# EAGLE design dfine_xb_v4 (EAGLE 5.06)
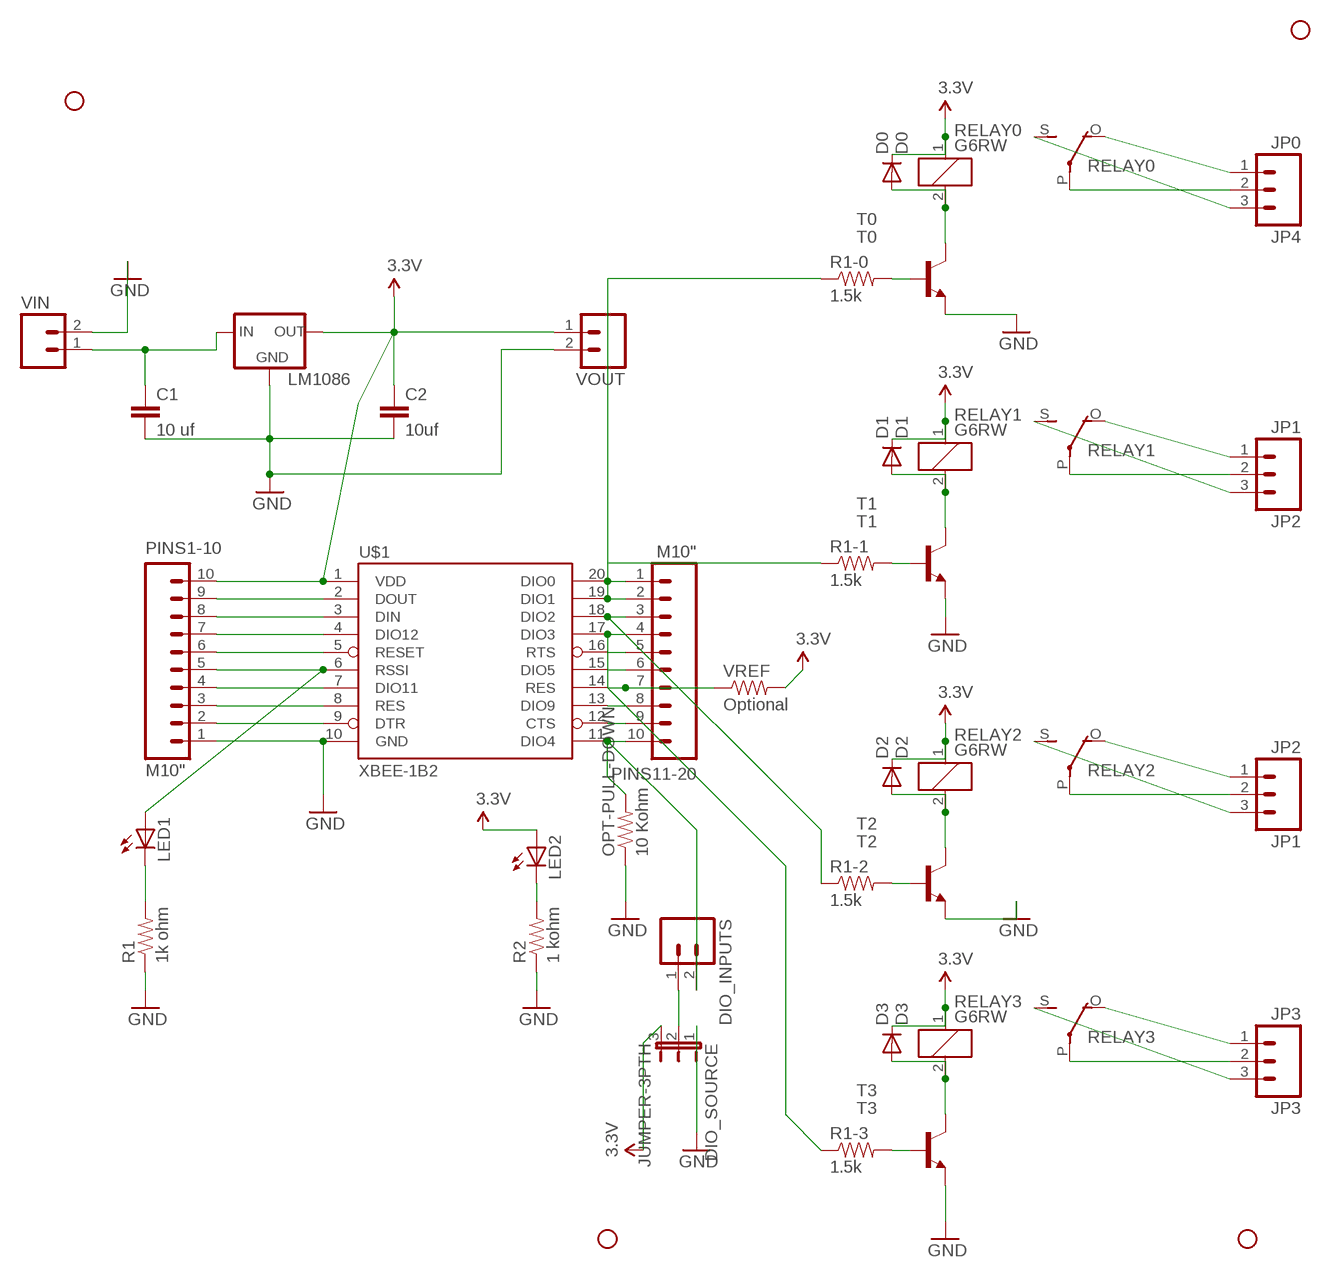
[diagram p0: schematic, sheet 1]

## Parts
C1  10 uf  CAPPTH  [CAP-PTH-SMALL]
C2  10uf  CAPPTH  [CAP-PTH-SMALL]
D0  D0  DIODEPTH  [DIODE-1N4001]
D1  D1  DIODEPTH  [DIODE-1N4001]
D2  D2  DIODEPTH  [DIODE-1N4001]
D3  D3  DIODEPTH  [DIODE-1N4001]
DIO_INPUTS  M023.5MM  [SCREWTERMINAL-3.5MM-2]
DIO_SOURCE  JUMPER-3PTH  [1X03]
JP1  JP2  M03SCREW  [SCREWTERMINAL-3.5MM-3]
JP2  JP1  M03SCREW  [SCREWTERMINAL-3.5MM-3]
JP3  JP3  M03SCREW  [SCREWTERMINAL-3.5MM-3]
JP4  JP0  M03SCREW  [SCREWTERMINAL-3.5MM-3]
JP5  STAND-OFF  [STAND-OFF]
JP6  STAND-OFF  [STAND-OFF]
JP7  STAND-OFF  [STAND-OFF]
JP8  STAND-OFF  [STAND-OFF]
LED1  LED3MM  [LED3MM]
LED2  LED3MM  [LED3MM]
LM1086  V_REG_78XXSINK  [TO220-IGO]
OPT-PULL-DOWN  10 Kohm  RESISTORPTH1  [AXIAL-0.3]
PINS1-10  M10"  [1X10]
PINS11-20  M10"  [1X10]
R1  1k ohm  RESISTORPTH1  [AXIAL-0.3]
R1-0  1.5k  RESISTORPTH1  [AXIAL-0.3]
R1-1  1.5k  RESISTORPTH1  [AXIAL-0.3]
R1-2  1.5k  RESISTORPTH1  [AXIAL-0.3]
R1-3  1.5k  RESISTORPTH1  [AXIAL-0.3]
R2  1 kohm  RESISTORPTH1  [AXIAL-0.3]
RELAY0  G6RW  [G6RW]
RELAY1  G6RW  [G6RW]
RELAY2  G6RW  [G6RW]
RELAY3  G6RW  [G6RW]
T0  T0  2N3565  [TO92]
T1  T1  2N3565  [TO92]
T2  T2  2N3565  [TO92]
T3  T3  2N3565  [TO92]
U$1  XBEE-1B2  [XBEE-SILK]
VIN  M023.5MM_LOCK  [SCREWTERMINAL-3.5MM-2_LOCK]
VOUT  M023.5MM  [SCREWTERMINAL-3.5MM-2]
VREF  Optional  RESISTORPTH1  [AXIAL-0.3]

## Nets
3.3V: C2.1 D0.C D1.C D2.C D3.C DIO_SOURCE.3 LED2.A LM1086.OUT PINS1-10.10 RELAY0.1 RELAY1.1 RELAY2.1 RELAY3.1 U$1.1(VDD) VOUT.1 VREF.P$2
GND: C1.2 C2.2 DIO_SOURCE.1 LM1086.GND OPT-PULL-DOWN.P$1 PINS1-10.1 R1.P$1 R2.P$1 T0.3(E) T1.3(E) T2.3(E) T3.3(E) U$1.10(GND) VIN.2 VOUT.2
N$1: PINS11-20.4 R1-3.P$1 U$1.17(DIO3)
N$2: PINS1-10.2 U$1.9(DTR)
N$3: PINS1-10.3 U$1.8(RES)
N$4: PINS1-10.4 U$1.7(DIO11)
N$5: LED1.A PINS1-10.5 U$1.6(RSSI)
N$6: PINS1-10.6 U$1.5(RESET)
N$7: PINS1-10.7 U$1.4(DIO12)
N$8: PINS1-10.8 U$1.3(DIN)
N$9: PINS1-10.9 U$1.2(DOUT)
N$10: PINS11-20.3 R1-2.P$1 U$1.18(DIO2)
N$11: R1-0.P$2 T0.2(B)
N$12: PINS11-20.2 R1-1.P$1 U$1.19(DIO1)
N$13: PINS11-20.1 R1-0.P$1 U$1.20(DIO0)
N$14: R1-1.P$2 T1.2(B)
N$15: PINS11-20.5 U$1.16(RTS)
N$16: PINS11-20.6 U$1.15(DIO5)
N$17: PINS11-20.7 U$1.14(RES) VREF.P$1
N$18: PINS11-20.8 U$1.13(DIO9)
N$19: PINS11-20.9 U$1.12(CTS)
N$21: JP4.1 RELAY0.O(2:O)
N$22: D0.A RELAY0.2 T0.1(C)
N$23: JP4.2 RELAY0.P(2:P)
N$24: D1.A RELAY1.2 T1.1(C)
N$25: C1.1 LM1086.IN VIN.1
N$26: LED1.K(C) R1.P$2
N$27: DIO_INPUTS.2 OPT-PULL-DOWN.P$2 PINS11-20.10 U$1.11(DIO4)
N$28: LED2.K(C) R2.P$2
N$29: R1-2.P$2 T2.2(B)
N$30: JP4.3 RELAY0.S(2:S)
N$31: JP2.1 RELAY1.O(2:O)
N$32: JP2.2 RELAY1.P(2:P)
N$33: JP2.3 RELAY1.S(2:S)
N$34: JP1.1 RELAY2.O(2:O)
N$35: D2.A RELAY2.2 T2.1(C)
N$36: R1-3.P$2 T3.2(B)
N$37: JP1.2 RELAY2.P(2:P)
N$38: JP1.3 RELAY2.S(2:S)
N$39: JP3.1 RELAY3.O(2:O)
N$40: JP3.2 RELAY3.P(2:P)
N$41: JP3.3 RELAY3.S(2:S)
N$42: D3.A RELAY3.2 T3.1(C)
N$43: DIO_INPUTS.1 DIO_SOURCE.2

## Library data of the parts
C1 C2 = SparkFun:CAP: Capacitor Standard 0603 ceramic capacitor, and 0.1" leaded capacitor.
D0 D1-D3 = SparkFun:DIODE: Diode These are standard reverse protection diodes and small signal diodes. SMA package can handle up to about 1A. SOD-323 can handle about 200mA. What the SOD-323 package when ordering, there are some mfgs out there that are 5-pin packages.
DIO_INPUTS VIN VOUT = SparkFun:M02: Header 2 Standard 2-pin 0.1" header. Use with straight break away headers (SKU : PRT-00116), right angle break away headers (PRT-00553), swiss pins (PRT-00743), machine pins (PRT-00117), and female headers (PRT-00115). Molex polarized connector foot print use with SKU : PRT-08233 with associated crimp pins and housings.
DIO_SOURCE = SparkFun:JUMPER-3
JP1-JP4 = SparkFun:M03: Header 3 Standard 3-pin 0.1" header. Use with straight break away headers (SKU : PRT-00116), right angle break away headers (PRT-00553), swiss pins (PRT-00743), machine pins (PRT-00117), and female headers (PRT-00115). Molex polarized connector foot print use with SKU : PRT-08232 with associated crimp pins and housings.
JP5-JP8 = SparkFun:STAND-OFF: Stand Off This is the mechanical footprint for a #4 phillips button head screw. Use the keepout ring to avoid running the screw head into surrounding components. SKU : PRT-00447
LED1 LED2 = SparkFun:LED: LEDs Standard schematic elements and footprints for 5mm, 3mm, 1206, and 0603 sized LEDs. 5mm - Spark Fun Electronics SKU : COM-00529 (and others)
LM1086 = SparkFun:V_REG_78XX: Voltage Regulator Standard 7805 5V regulator. IGO (Input Ground Output). Spark Fun Electronics SKU : COM-00107
OPT-PULL-DOWN R1 R1-0 R1-1-R1-3 R2 VREF = SparkFun:RESISTOR: Resistor Basic schematic elements and footprints for 0603, 1206, and PTH 1/10th watt (small) resistors.
PINS1-10 PINS11-20 = SparkFun:M10: Header 10 Standard 10-pin 0.1" header. Use with straight break away headers (SKU : PRT-00116), right angle break away headers (PRT-00553), swiss pins (PRT-00743), machine pins (PRT-00117), and female headers (PRT-00115).
RELAY0 RELAY1-RELAY3 = relay:G6RW: RELAY 1 x switch, Omron
T0 T1-T3 = transistor-npn:2N3565: NPN Transistor
U$1 = SparkFun:XBEE-1

## Board
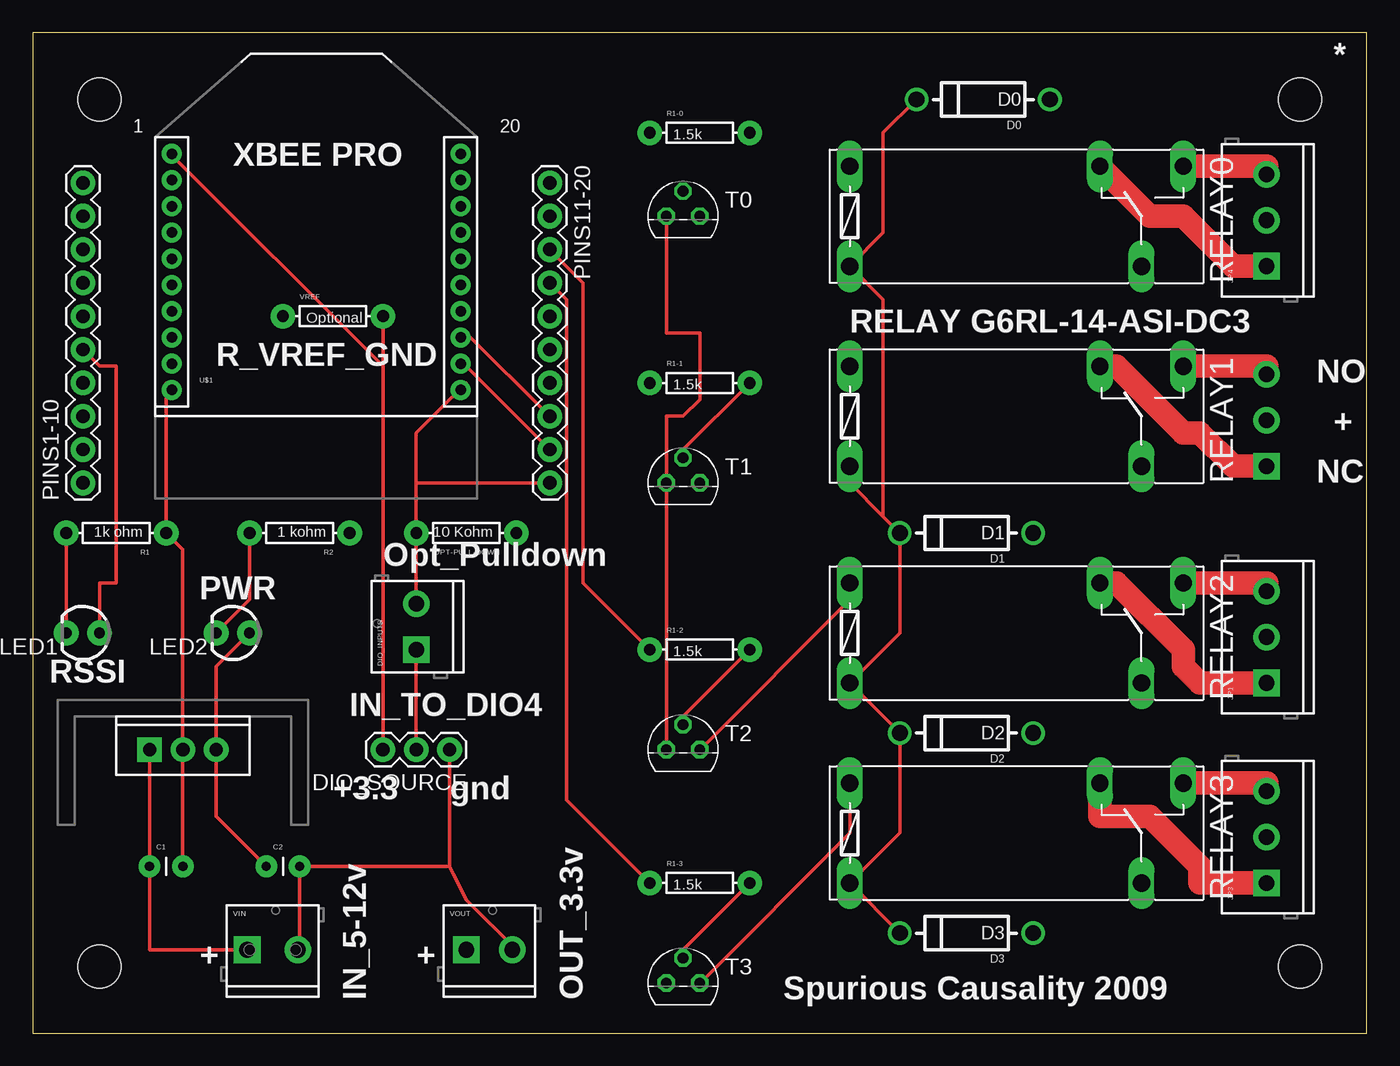
[diagram p1: board, top side]
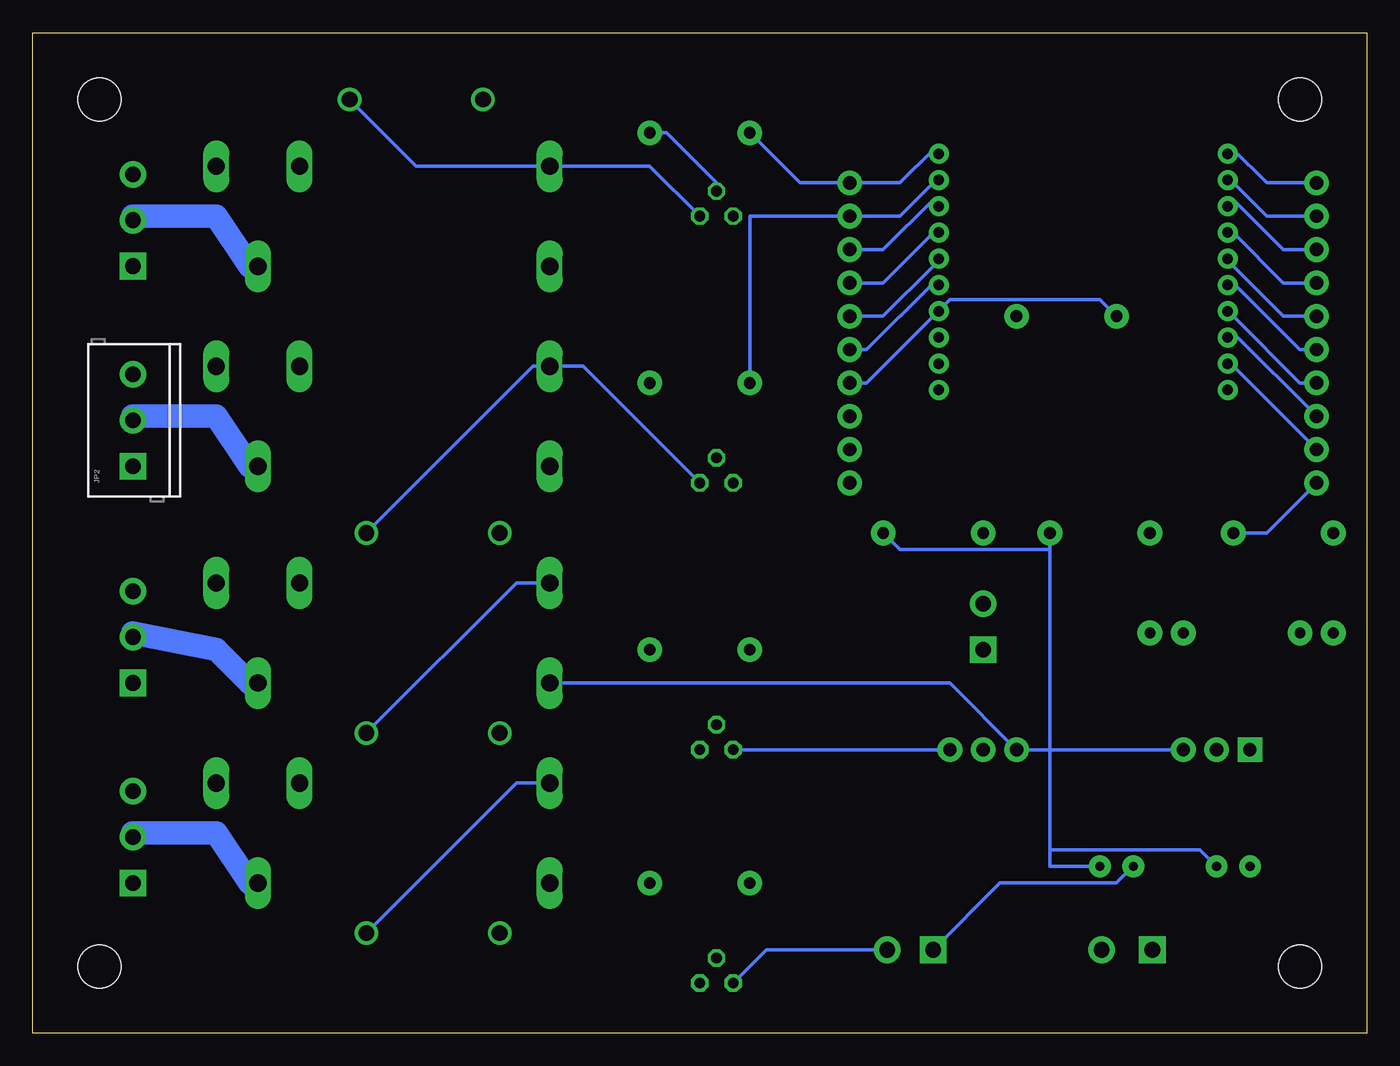
[diagram p2: board, bottom side, seen from below]

Size 101.6 x 76.2 mm. Coordinates in mm from the lower left corner, seen from the top.
Outline: 0,0 101.6,0 101.6,76.2 0,76.19 0,0
Copper layers (1*16): Top 0.035mm / dielectric 1.5mm / Bottom 0.035mm
Design rules "default": minimum track width 10mil, minimum drill 24mil, track to track 8mil, track to pad 8mil, pad to pad 8mil, via to via 8mil, smd to smd 8mil, copper to edge 40mil, drill to drill 8mil, minimum pad ring 10mil, minimum via ring 8mil, stop-mask expansion 4mil, vias tented up to drill 0mil, thermal gap 10mil

### Footprints (pad centres in the part's own frame; a part is rotated, then mirrored left to right if it is on the bottom)
CAP-PTH-SMALL = drill 0.7 pad 1.651 round: 1 0,0; 2 2.54,0
DIODE-1N4001 = drill 1.2 round: A -5.08,0; C 5.08,0
SCREWTERMINAL-3.5MM-2 = drill 1.2 pad 2.032 square: 1 0,0 | drill 1.2 pad 2.032 round: 2 3.5,0
1X03 = drill 1.016 pad 1.88 round: 1 0,0; 2 2.54,0; 3 5.08,0
SCREWTERMINAL-3.5MM-3 = drill 1.2 pad 2.032 square: 1 0,0 | drill 1.2 pad 2.032 round: 2 3.5,0; 3 7,0
STAND-OFF = hole 3.302: 0,0
LED3MM = drill 0.813 pad 1.88 round: A -1.27,0; K 1.27,0
TO220-IGO = drill 1 pad 1.88 round: GND 0,0; OUT 2.54,0 | drill 1 pad 1.88 square: IN -2.54,0
AXIAL-0.3 = drill 0.9 pad 1.88 round: P$1 -3.81,0; P$2 3.81,0
1X10 = drill 1.016 pad 1.88 round: 1 0,0; 2 2.54,0; 3 5.08,0; 4 7.62,0; 5 10.16,0; 6 12.7,0; 7 15.24,0; 8 17.78,0; 9 20.32,0; 10 22.86,0
G6RW = drill 1.321 long: 1 -12.7,-3.81; 2 -12.7,3.81; O 6.35,3.81; P 9.525,-3.81; S 12.7,3.81
TO92 = drill 0.813 octagon: 1 1.27,0; 2 0,1.905; 3 -1.27,0
XBEE-SILK = drill 0.8 pad 1.524 round: 1 -11,20; 2 -11,18; 3 -11,16; 4 -11,14; 5 -11,12; 6 -11,10; 7 -11,8; 8 -11,6; 9 -11,4; 10 -11,2; 11 11,2; 12 11,4; 13 11,6; 14 11,8; 15 11,10; 16 11,12; 17 11,14; 18 11,16; 19 11,18; 20 11,20
SCREWTERMINAL-3.5MM-2_LOCK = drill 1.2 pad 2.032 square: 1 -0.178,0 | drill 1.2 pad 2.032 round: 2 3.678,0

### Placement (x,y rotation side)
C1  8.89,12.7 0 top
C2  17.78,12.7 0 top
D0  72.39,71.12 180 top
D1  71.12,38.1 180 top
D2  71.12,22.86 180 top
D3  71.12,7.62 180 top
DIO_INPUTS  29.21,29.21 90 top
DIO_SOURCE  31.75,21.59 180 top
JP1  93.98,26.67 90 top
JP2  93.98,43.18 90 bottom
JP3  93.98,11.43 90 top
JP4  93.98,58.42 90 top
JP5  5.08,71.12 0 top
JP6  96.52,71.12 0 top
JP7  5.08,5.08 0 top
JP8  96.52,5.08 0 top
LED1  3.81,30.48 180 top
LED2  15.24,30.48 180 top
LM1086  11.43,21.59 0 top
OPT-PULL-DOWN  33.02,38.1 180 top
PINS1-10  3.81,41.91 90 top
PINS11-20  39.37,64.77 270 top
R1  6.35,38.1 180 top
R1-0  50.8,68.58 0 top
R1-1  50.8,49.53 0 top
R1-2  50.8,29.21 0 top
R1-3  50.8,11.43 0 top
R2  20.32,38.1 180 top
RELAY0  74.93,62.23 0 top
RELAY1  74.93,46.99 0 top
RELAY2  74.93,30.48 0 top
RELAY3  74.93,15.24 0 top
T0  49.53,62.23 0 top
T1  49.53,41.91 0 top
T2  49.53,21.59 0 top
T3  49.53,3.81 0 top
U$1  21.59,46.99 0 top
VIN  16.51,6.35 0 top
VOUT  33.02,6.35 0 top
VREF  22.86,54.61 0 top

### Tracks (layer width: path | path; a pad name or v marks a point on that pad's centre or on a via)
3.3V
  Top 0.254: C2.1 13.97,16.51 LM1086.OUT 13.97,27.94 LED2.A | DIO_SOURCE.3 26.67,50.8 | 26.67,50.8 VREF.P$2 | 26.67,50.8 10.16,67.31 U$1.1 | D0.C 64.77,68.58 64.77,60.96 RELAY0.1 64.77,55.88 64.77,39.37 | D3.C RELAY3.1 66.04,15.24 D2.C RELAY2.1 66.04,30.48 D1.C 64.77,39.37 | 64.77,39.37 62.23,41.91 RELAY1.1
  Bottom 0.254: PINS1-10.10 7.62,64.77 10.16,67.31 U$1.1 | LM1086.OUT DIO_SOURCE.3 31.75,26.67 RELAY2.1 | VOUT.1 27.94,11.43 19.05,11.43 C2.1
GND
  Top 0.254: C1.2 LM1086.GND 11.43,36.83 R1.P$1 10.16,49.53 U$1.10 | VIN.2 20.32,6.35 C2.2 31.75,12.7 | 31.75,12.7 DIO_SOURCE.1 | 31.75,12.7 33.02,10.16 36.83,6.35 VOUT.2 | T2.3 T1.3 48.26,46.99 49.53,46.99 50.8,48.26 50.8,53.34 48.26,53.34 T0.3
  Bottom 0.254: 24.13,13.97 24.13,12.7 C2.2 | 24.13,13.97 24.13,36.83 | OPT-PULL-DOWN.P$1 35.56,36.83 24.13,36.83 | C1.2 12.7,13.97 24.13,13.97 | T3.3 45.72,6.35 VOUT.2 | DIO_SOURCE.1 T2.3 | PINS1-10.1 7.62,38.1 R1.P$1 | 24.13,36.83 R2.P$1
N$1
  Top 0.254: R1-3.P$1 40.64,17.78 40.64,55.88 PINS11-20.4
  Bottom 0.254: PINS11-20.4 36.83,57.15 33.02,60.96 U$1.17
N$2
  Bottom 0.254: PINS1-10.2 10.16,50.8 U$1.9
N$3
  Bottom 0.254: PINS1-10.3 10.16,53.34 U$1.8
N$4
  Bottom 0.254: PINS1-10.4 5.08,49.53 10.16,54.61 U$1.7
N$5
  Top 0.254: PINS1-10.5 5.08,50.8 6.35,50.8 6.35,34.29 5.08,34.29 LED1.A
  Bottom 0.254: PINS1-10.5 5.08,52.07 10.16,57.15 U$1.6
N$6
  Bottom 0.254: PINS1-10.6 6.35,54.61 10.16,58.42 U$1.5
N$7
  Bottom 0.254: PINS1-10.7 6.35,57.15 10.16,60.96 U$1.4
N$8
  Bottom 0.254: PINS1-10.8 6.35,59.69 10.16,63.5 U$1.3
N$9
  Bottom 0.254: PINS1-10.9 7.62,62.23 10.16,64.77 U$1.2
N$10
  Top 0.254: R1-2.P$1 41.91,34.29 41.91,57.15 PINS11-20.3
  Bottom 0.254: PINS11-20.3 36.83,59.69 33.02,63.5 U$1.18
N$11
  Bottom 0.254: R1-0.P$2 53.34,68.58 49.53,64.77 T0.2
N$12
  Bottom 0.254: U$1.19 33.02,64.77 35.56,62.23 PINS11-20.2 46.99,62.23 R1-1.P$1
N$13
  Bottom 0.254: U$1.20 33.02,67.31 35.56,64.77 PINS11-20.1 43.18,64.77 R1-0.P$1
N$14
  Top 0.254: R1-1.P$2 49.53,44.45 T1.2
N$15
  Bottom 0.254: PINS11-20.5 36.83,54.61 33.02,58.42 U$1.16
N$16
  Bottom 0.254: PINS11-20.6 38.1,52.07 33.02,57.15 U$1.15
N$17
  Bottom 0.254: 33.02,54.61 38.1,49.53 PINS11-20.7 | VREF.P$1 20.32,55.88 31.75,55.88 33.02,54.61 | 33.02,54.61 U$1.14
N$18
  Top 0.254: PINS11-20.8 33.02,53.34 U$1.13
N$19
  Top 0.254: PINS11-20.9 33.02,50.8 U$1.12
N$21
  Top 1.778: RELAY0.O 85.09,62.23 87.63,62.23 91.44,58.42 JP4.1
N$22
  Bottom 0.254: T0.1 54.61,66.04 RELAY0.2 72.39,66.04 D0.A
N$23
  Bottom 0.254: RELAY0.P 85.09,58.42 | 93.98,62.23 JP4.2
  Bottom 1.778: 85.09,58.42 87.63,62.23 93.98,62.23
N$24
  Bottom 0.254: T1.1 59.69,50.8 RELAY1.2 63.5,50.8 D1.A
N$25
  Top 0.254: LM1086.IN C1.1 8.89,6.35 VIN.1 16.51,6.35
N$26
  Top 0.254: LED1.K R1.P$2
N$27
  Top 0.254: 29.21,41.91 OPT-PULL-DOWN.P$2 DIO_INPUTS.2 | 29.21,41.91 29.21,45.72 33.02,49.53 U$1.11 | 29.21,41.91 PINS11-20.10
N$28
  Top 0.254: LED2.K 16.51,33.02 R2.P$2
N$29
  Top 0.254: R1-2.P$2 49.53,24.13 T2.2
N$30
  Top 0.254: 93.98,66.04 JP4.3
  Top 1.778: RELAY0.S 93.98,66.04
N$31
  Top 1.778: RELAY1.O 82.55,50.8 87.63,45.72 88.9,45.72 91.44,43.18 JP2.1
N$32
  Bottom 0.254: RELAY1.P 85.09,43.18 | 93.98,46.99 JP2.2
  Bottom 1.778: 85.09,43.18 87.63,46.99 93.98,46.99
N$33
  Top 0.254: 93.98,50.8 JP2.3
  Top 1.778: RELAY1.S 93.98,50.8
N$34
  Top 1.778: JP1.1 88.9,26.67 87.63,27.94 87.63,29.21 82.55,34.29 RELAY2.O
N$35
  Top 0.254: T2.1 62.23,33.02 RELAY2.2
  Bottom 0.254: D2.A 64.77,34.29 RELAY2.2
N$36
  Top 0.254: R1-3.P$2 49.53,6.35 T3.2
N$37
  Bottom 0.254: RELAY2.P 85.09,26.67 | 93.98,30.48 JP1.2
  Bottom 1.778: 85.09,26.67 87.63,29.21 93.98,30.48
N$38
  Top 0.254: 93.98,34.29 JP1.3
  Top 1.778: RELAY2.S 93.98,34.29
N$39
  Top 1.778: JP3.1 88.9,11.43 88.9,12.7 85.09,16.51 81.28,16.51 RELAY3.O
N$40
  Bottom 0.254: RELAY3.P 85.09,11.43 | 93.98,15.24 JP3.2
  Bottom 1.778: 85.09,11.43 87.63,15.24 93.98,15.24
N$41
  Top 0.254: 93.98,19.05 JP3.3
  Top 1.778: RELAY3.S 93.98,19.05
N$42
  Top 0.254: T3.1 62.23,15.24 RELAY3.2
  Bottom 0.254: D3.A 64.77,19.05 RELAY3.2
N$43
  Top 0.254: DIO_SOURCE.2 DIO_INPUTS.1

### Text on the board
tPlace: * | 1 | 20 | XBEE PRO | RELAY G6RL-14-ASI-DC3 | R_VREF_GND | NO | + | NC | Opt_Pulldown | PWR | RSSI | IN_TO_DIO4 | +3.3 | gnd | + | + | IN_5-12v | OUT_3.3v | Spurious Causality 2009